# EAGLE design TRISThisv2p0 (EAGLE 5.12)

## Sheet 1 of 2
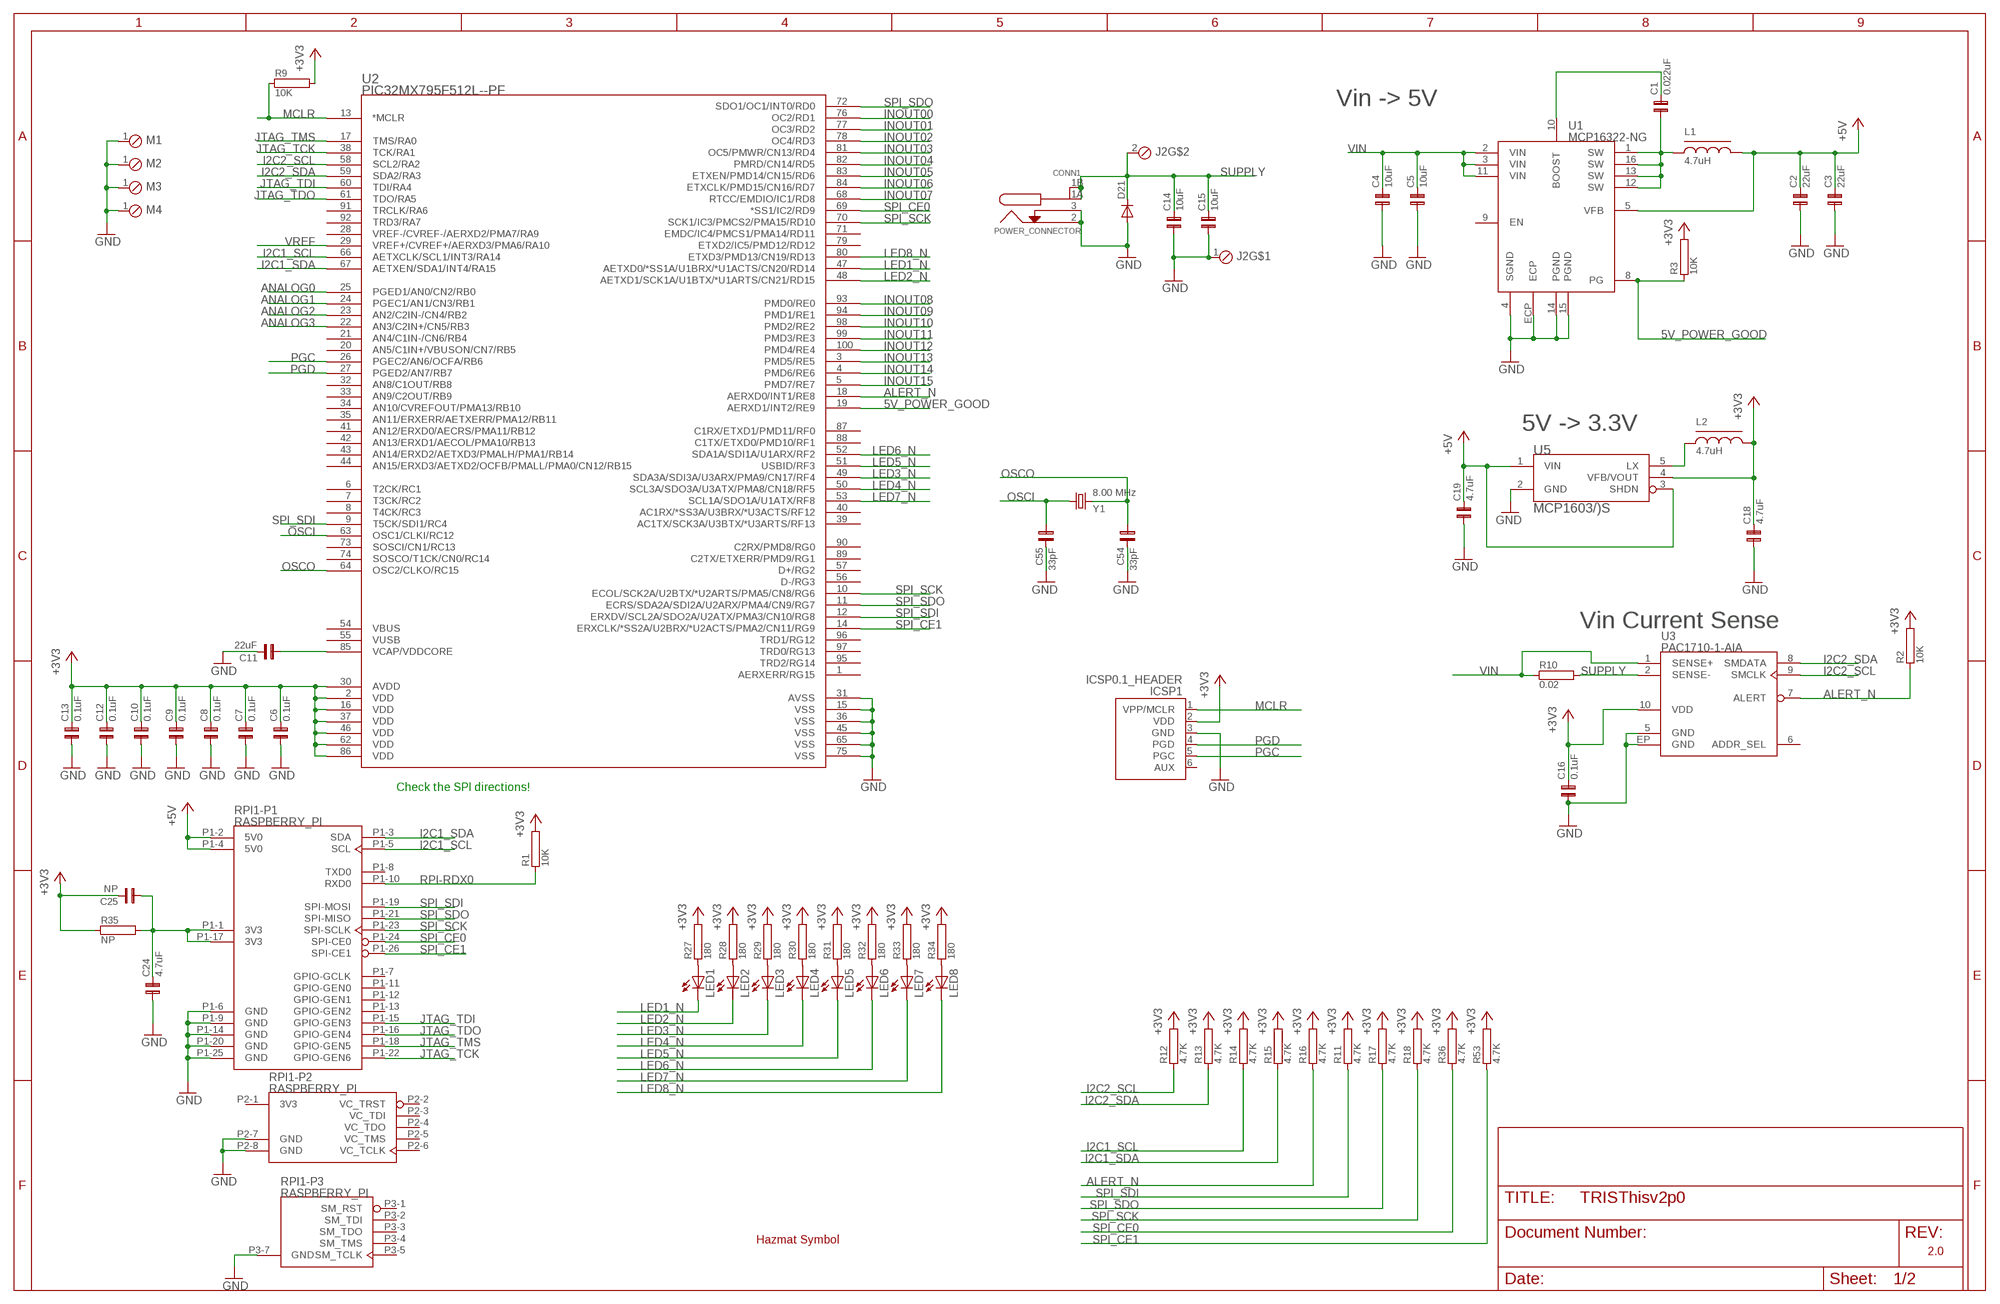
[diagram p0: schematic, sheet 1]

### Parts
C1  0.022uF  CU_SMT0603  [C0603]
C2  22uF  CU_SMT0805  [C0805]
C3  22uF  CU_SMT0805  [C0805]
C4  10uF  CU_SMT0805  [C0805]
C5  10uF  CU_SMT0805  [C0805]
C6  0.1uF  CU_SMT0603  [C0603]
C7  0.1uF  CU_SMT0603  [C0603]
C8  0.1uF  CU_SMT0603  [C0603]
C9  0.1uF  CU_SMT0603  [C0603]
C10  0.1uF  CU_SMT0603  [C0603]
C11  22uF  CU_SMT0805  [C0805]
C12  0.1uF  CU_SMT0603  [C0603]
C13  0.1uF  CU_SMT0603  [C0603]
C14  10uF  CU_SMT0805  [C0805]
C15  10uF  CU_SMT0805  [C0805]
C16  0.1uF  CU_SMT0603  [C0603]
C18  4.7uF  CU_SMT0805  [C0805]
C19  4.7uF  CU_SMT0805  [C0805]
C24  4.7uF  CU_SMT0805  [C0805]
C25  NP  CU_SMT0805  [C0805]
C54  33pF  CU_SMT0603  [C0603]
C55  33pF  CU_SMT0603  [C0603]
CONN1  POWER_CONNECTOR  [PJ-002BH-SMT]
D21  SOD-123  [SOD-123]
ICSP1  ICSP0.1_HEADER  [ICSP]
J2  2P_HEADER  [2POL254]
L1  4.7uH  L_SMTWE-PD  [WE-PD]
L2  4.7uH  L_SMTWE-PD  [WE-PD]
LED1  LEDCHIPLED_0603  [CHIPLED_0603]
LED2  LEDCHIPLED_0603  [CHIPLED_0603]
LED3  LEDCHIPLED_0603  [CHIPLED_0603]
LED4  LEDCHIPLED_0603  [CHIPLED_0603]
LED5  LEDCHIPLED_0603  [CHIPLED_0603]
LED6  LEDCHIPLED_0603  [CHIPLED_0603]
LED7  LEDCHIPLED_0603  [CHIPLED_0603]
LED8  LEDCHIPLED_0603  [CHIPLED_0603]
M1  MOUNTING  [0125_MOUNT]
M2  MOUNTING  [0125_MOUNT]
M3  MOUNTING  [0125_MOUNT]
M4  MOUNTING  [0125_MOUNT]
R1  10K  R_SMT0603  [R0603]
R2  10K  R_SMT0603  [R0603]
R3  10K  R_SMT0603  [R0603]
R9  10K  R_SMT0603  [R0603]
R10  0.02  R_SMT1210  [R1210]
R11  4.7K  R_SMT0603  [R0603]
R12  4.7K  R_SMT0603  [R0603]
R13  4.7K  R_SMT0603  [R0603]
R14  4.7K  R_SMT0603  [R0603]
R15  4.7K  R_SMT0603  [R0603]
R16  4.7K  R_SMT0603  [R0603]
R17  4.7K  R_SMT0603  [R0603]
R18  4.7K  R_SMT0603  [R0603]
R27  180  R_SMT0603  [R0603]
R28  180  R_SMT0603  [R0603]
R29  180  R_SMT0603  [R0603]
R30  180  R_SMT0603  [R0603]
R31  180  R_SMT0603  [R0603]
R32  180  R_SMT0603  [R0603]
R33  180  R_SMT0603  [R0603]
R34  180  R_SMT0603  [R0603]
R35  NP  R_SMT0603  [R0603]
R36  4.7K  R_SMT0603  [R0603]
R53  4.7K  R_SMT0603  [R0603]
RPI1  RASPBERRY_PI  [RPI]
U1  MCP16322-NG  [NG]
U2  PIC32MX795F512L--PF  [TQFP100_14X14]
U3  PAC1710-1-AIA  [DFN10]
U5  MCP1603/)S  MCP1603/OS  [TSOT5_MC]
U$1  HAZMATSYMBOL  [HAZMATSYMBOL]
Y1  8.00 MHz  CS10  [CS10]

### Nets
5V_POWER_GOOD: R3.1 U1.8(PG) U2.19(AERXD1/INT2/RE9)
+3V3: C6.2 C7.2 C8.2 C9.2 C10.2 C12.2 C13.2 C16.2 C18.2 C25.2 ICSP1.2(VDD) L2.2 R1.2 R2.2 R3.2 R9.2 R11.2 R12.2 R13.2 R14.2 R15.2 R16.2 R17.2 R18.2 R27.2 R28.2 R29.2 R30.2 R31.2 R32.2 R33.2 R34.2 R35.1 R36.2 R53.2 U2.2(VDD) U2.16(VDD) U2.30(AVDD) U2.37(VDD) U2.46(VDD) U2.62(VDD) U2.86(VDD) U3.10(VDD) U5.4(VFB/VOUT) ; also sheet 2
+5V: C2.2 C3.2 C19.2 L1.2 RPI1.P1-2(-P1:5V0) RPI1.P1-4(-P1:5V0) U1.5(VFB) U5.1(VIN) U5.3(SHDN)
ALERT_N: R2.1 R16.1 U2.18(AERXD0/INT1/RE8) U3.7(ALERT)
ANALOG0: U2.25(PGED1/AN0/CN2/RB0) ; also sheet 2
ANALOG1: U2.24(PGEC1/AN1/CN3/RB1) ; also sheet 2
ANALOG2: U2.23(AN2/C2IN-/CN4/RB2) ; also sheet 2
ANALOG3: U2.22(AN3/C2IN+/CN5/RB3) ; also sheet 2
BOOST: C1.2 U1.10(BOOST)
GND: C2.1 C3.1 C4.1 C5.1 C6.1 C7.1 C8.1 C9.1 C10.1 C11.2 C12.1 C13.1 C14.1 C15.1 C16.1 C18.1 C19.1 C24.1 C54.2 C55.2 CONN1.2(SHIELD) CONN1.3(SHIELD_SWITCHED) D21.A ICSP1.3(GND) J2.1 M1.1 M2.1 M3.1 M4.1 RPI1.P1-6(-P1:GND) RPI1.P1-9(-P1:GND) RPI1.P1-14(-P1:GND) RPI1.P1-20(-P1:GND) RPI1.P1-25(-P1:GND) RPI1.P2-7(-P2:GND) RPI1.P2-8(-P2:GND) RPI1.P3-7(-P3:GND) U1.4(SGND) U1.14(PGND) U1.15(PGND) U1.ECP U2.15(VSS) U2.31(AVSS) U2.36(VSS) U2.45(VSS) U2.65(VSS) U2.75(VSS) U3.5(GND) U3.EP(GND) U5.2(GND) ; also sheet 2
I2C1_SCL: R14.1 RPI1.P1-5(-P1:SCL) U2.66(AETXCLK/SCL1/INT3/RA14)
I2C1_SDA: R15.1 RPI1.P1-3(-P1:SDA) U2.67(AETXEN/SDA1/INT4/RA15)
I2C2_SCL: R12.1 U2.58(SCL2/RA2) U3.9(SMCLK) ; also sheet 2
I2C2_SDA: R13.1 U2.59(SDA2/RA3) U3.8(SMDATA) ; also sheet 2
INOUT00: U2.76(OC2/RD1) ; also sheet 2
INOUT01: U2.77(OC3/RD2) ; also sheet 2
INOUT02: U2.78(OC4/RD3) ; also sheet 2
INOUT03: U2.81(OC5/PMWR/CN13/RD4) ; also sheet 2
INOUT04: U2.82(PMRD/CN14/RD5) ; also sheet 2
INOUT05: U2.83(ETXEN/PMD14/CN15/RD6) ; also sheet 2
INOUT06: U2.84(ETXCLK/PMD15/CN16/RD7) ; also sheet 2
INOUT07: U2.68(RTCC/EMDIO/IC1/RD8) ; also sheet 2
INOUT08: U2.93(PMD0/RE0) ; also sheet 2
INOUT09: U2.94(PMD1/RE1) ; also sheet 2
INOUT10: U2.98(PMD2/RE2) ; also sheet 2
INOUT11: U2.99(PMD3/RE3) ; also sheet 2
INOUT12: U2.100(PMD4/RE4) ; also sheet 2
INOUT13: U2.3(PMD5/RE5) ; also sheet 2
INOUT14: U2.4(PMD6/RE6) ; also sheet 2
INOUT15: U2.5(PMD7/RE7) ; also sheet 2
JTAG_TCK: RPI1.P1-22(-P1:GPIO-GEN6) U2.38(TCK/RA1)
JTAG_TDI: RPI1.P1-15(-P1:GPIO-GEN3) U2.60(TDI/RA4)
JTAG_TDO: RPI1.P1-16(-P1:GPIO-GEN4) U2.61(TDO/RA5)
JTAG_TMS: RPI1.P1-18(-P1:GPIO-GEN5) U2.17(TMS/RA0)
LED1_N: LED1.C U2.47(AETXD0/*SS1A/U1BRX/*U1ACTS/CN20/RD14)
LED2_N: LED2.C U2.48(AETXD1/SCK1A/U1BTX/*U1ARTS/CN21/RD15)
LED3_N: LED3.C U2.49(SDA3A/SDI3A/U3ARX/PMA9/CN17/RF4)
LED4_N: LED4.C U2.50(SCL3A/SDO3A/U3ATX/PMA8/CN18/RF5)
LED5_N: LED5.C U2.51(USBID/RF3)
LED6_N: LED6.C U2.52(SDA1A/SDI1A/U1ARX/RF2)
LED7_N: LED7.C U2.53(SCL1A/SDO1A/U1ATX/RF8)
LED8_N: LED8.C U2.80(ETXD3/PMD13/CN19/RD13)
MCLR: ICSP1.1(VPP/MCLR) R9.1 U2.13(*MCLR)
N$5: LED1.A R27.1
N$11: LED2.A R28.1
N$13: LED3.A R29.1
N$14: LED4.A R30.1
N$15: LED5.A R31.1
N$16: LED6.A R32.1
N$17: LED7.A R33.1
N$18: LED8.A R34.1
OSCI: C55.1 U2.63(OSC1/CLKI/RC12) Y1.P$1
OSCO: C54.1 U2.64(OSC2/CLKO/RC15) Y1.P$2
PGC: ICSP1.5(PGC) U2.26(PGEC2/AN6/OCFA/RB6)
PGD: ICSP1.4(PGD) U2.27(PGED2/AN7/RB7)
RPI+3V3: C24.2 C25.1 R35.2 RPI1.P1-1(-P1:3V3) RPI1.P1-17(-P1:3V3)
RPI-RDX0: R1.1 RPI1.P1-10(-P1:RXD0)
SPI_CE0: R36.1 RPI1.P1-24(-P1:SPI-CE0) U2.69(*SS1/IC2/RD9)
SPI_CE1: R53.1 RPI1.P1-26(-P1:SPI-CE1) U2.14(ERXCLK/*SS2A/U2BRX/*U2ACTS/PMA2/CN11/RG9)
SPI_SCK: R18.1 RPI1.P1-23(-P1:SPI-SCLK) U2.10(ECOL/SCK2A/U2BTX/*U2ARTS/PMA5/CN8/RG6) U2.70(SCK1/IC3/PMCS2/PMA15/RD10)
SPI_SDI: R11.1 RPI1.P1-19(-P1:SPI-MOSI) U2.9(T5CK/SDI1/RC4) U2.12(ERXDV/SCL2A/SDO2A/U2ATX/PMA3/CN10/RG8)
SPI_SDO: R17.1 RPI1.P1-21(-P1:SPI-MISO) U2.11(ECRS/SDA2A/SDI2A/U2ARX/PMA4/CN9/RG7) U2.72(SDO1/OC1/INT0/RD0)
SUPPLY: C14.2 C15.2 CONN1.1A(CENTER-1) CONN1.1B(CENTER-2) D21.K J2.2 R10.2 U3.2(SENSE-)
SW: C1.1 L1.1 U1.1(SW) U1.12(SW) U1.13(SW) U1.16(SW)
U5_SWITCH: L2.1 U5.5(LX)
VDDCORE: C11.1 U2.85(VCAP/VDDCORE)
VIN: C4.2 C5.2 R10.1 U1.2(VIN) U1.3(VIN) U1.11(VIN) U3.1(SENSE+)
VREF: U2.29(VREF+/CVREF+/AERXD3/PMA6/RA10) ; also sheet 2
Unconnected: ICSP1.6(AUX) RPI1.P1-7(-P1:GPIO-GCLK) RPI1.P1-8(-P1:TXD0) RPI1.P1-11(-P1:GPIO-GEN0) RPI1.P1-12(-P1:GPIO-GEN1) RPI1.P1-13(-P1:GPIO-GEN2) RPI1.P2-2(-P2:VC_TRST) RPI1.P2-3(-P2:VC_TDI) RPI1.P2-4(-P2:VC_TDO) RPI1.P2-5(-P2:VC_TMS) RPI1.P2-6(-P2:VC_TCLK) RPI1.P3-1(-P3:SM_RST) RPI1.P3-2(-P3:SM_TDI) RPI1.P3-3(-P3:SM_TDO) RPI1.P3-4(-P3:SM_TMS) RPI1.P3-5(-P3:SM_TCLK) U1.9(EN) U2.1(AERXERR/RG15) U2.6(T2CK/RC1) U2.7(T3CK/RC2) U2.8(T4CK/RC3) U2.20(AN5/C1IN+/VBUSON/CN7/RB5) U2.21(AN4/C1IN-/CN6/RB4) U2.28(VREF-/CVREF-/AERXD2/PMA7/RA9) U2.32(AN8/C1OUT/RB8) U2.33(AN9/C2OUT/RB9) U2.34(AN10/CVREFOUT/PMA13/RB10) U2.35(AN11/ERXERR/AETXERR/PMA12/RB11) U2.39(AC1TX/SCK3A/U3BTX/*U3ARTS/RF13) U2.40(AC1RX/*SS3A/U3BRX/*U3ACTS/RF12) U2.41(AN12/ERXD0/AECRS/PMA11/RB12) U2.42(AN13/ERXD1/AECOL/PMA10/RB13) U2.43(AN14/ERXD2/AETXD3/PMALH/PMA1/RB14) U2.44(AN15/ERXD3/AETXD2/OCFB/PMALL/PMA0/CN12/RB15) U2.54(VBUS) U2.55(VUSB) U2.56(D-/RG3) U2.57(D+/RG2) U2.71(EMDC/IC4/PMCS1/PMA14/RD11) U2.73(SOSCI/CN1/RC13) U2.74(SOSCO/T1CK/CN0/RC14) U2.79(ETXD2/IC5/PMD12/RD12) U2.87(C1RX/ETXD1/PMD11/RF0) U2.88(C1TX/ETXD0/PMD10/RF1) U2.89(C2TX/ETXERR/PMD9/RG1) U2.90(C2RX/PMD8/RG0) U2.91(TRCLK/RA6) U2.92(TRD3/RA7) U2.95(TRD2/RG14) U2.96(TRD1/RG12) U2.97(TRD0/RG13) U3.6(ADDR_SEL)

### Notes on the sheet
- Vin -> 5V
- 5V -> 3.3V
- Vin Current Sense
- Check the SPI directions!
- 2.0

## Sheet 2 of 2
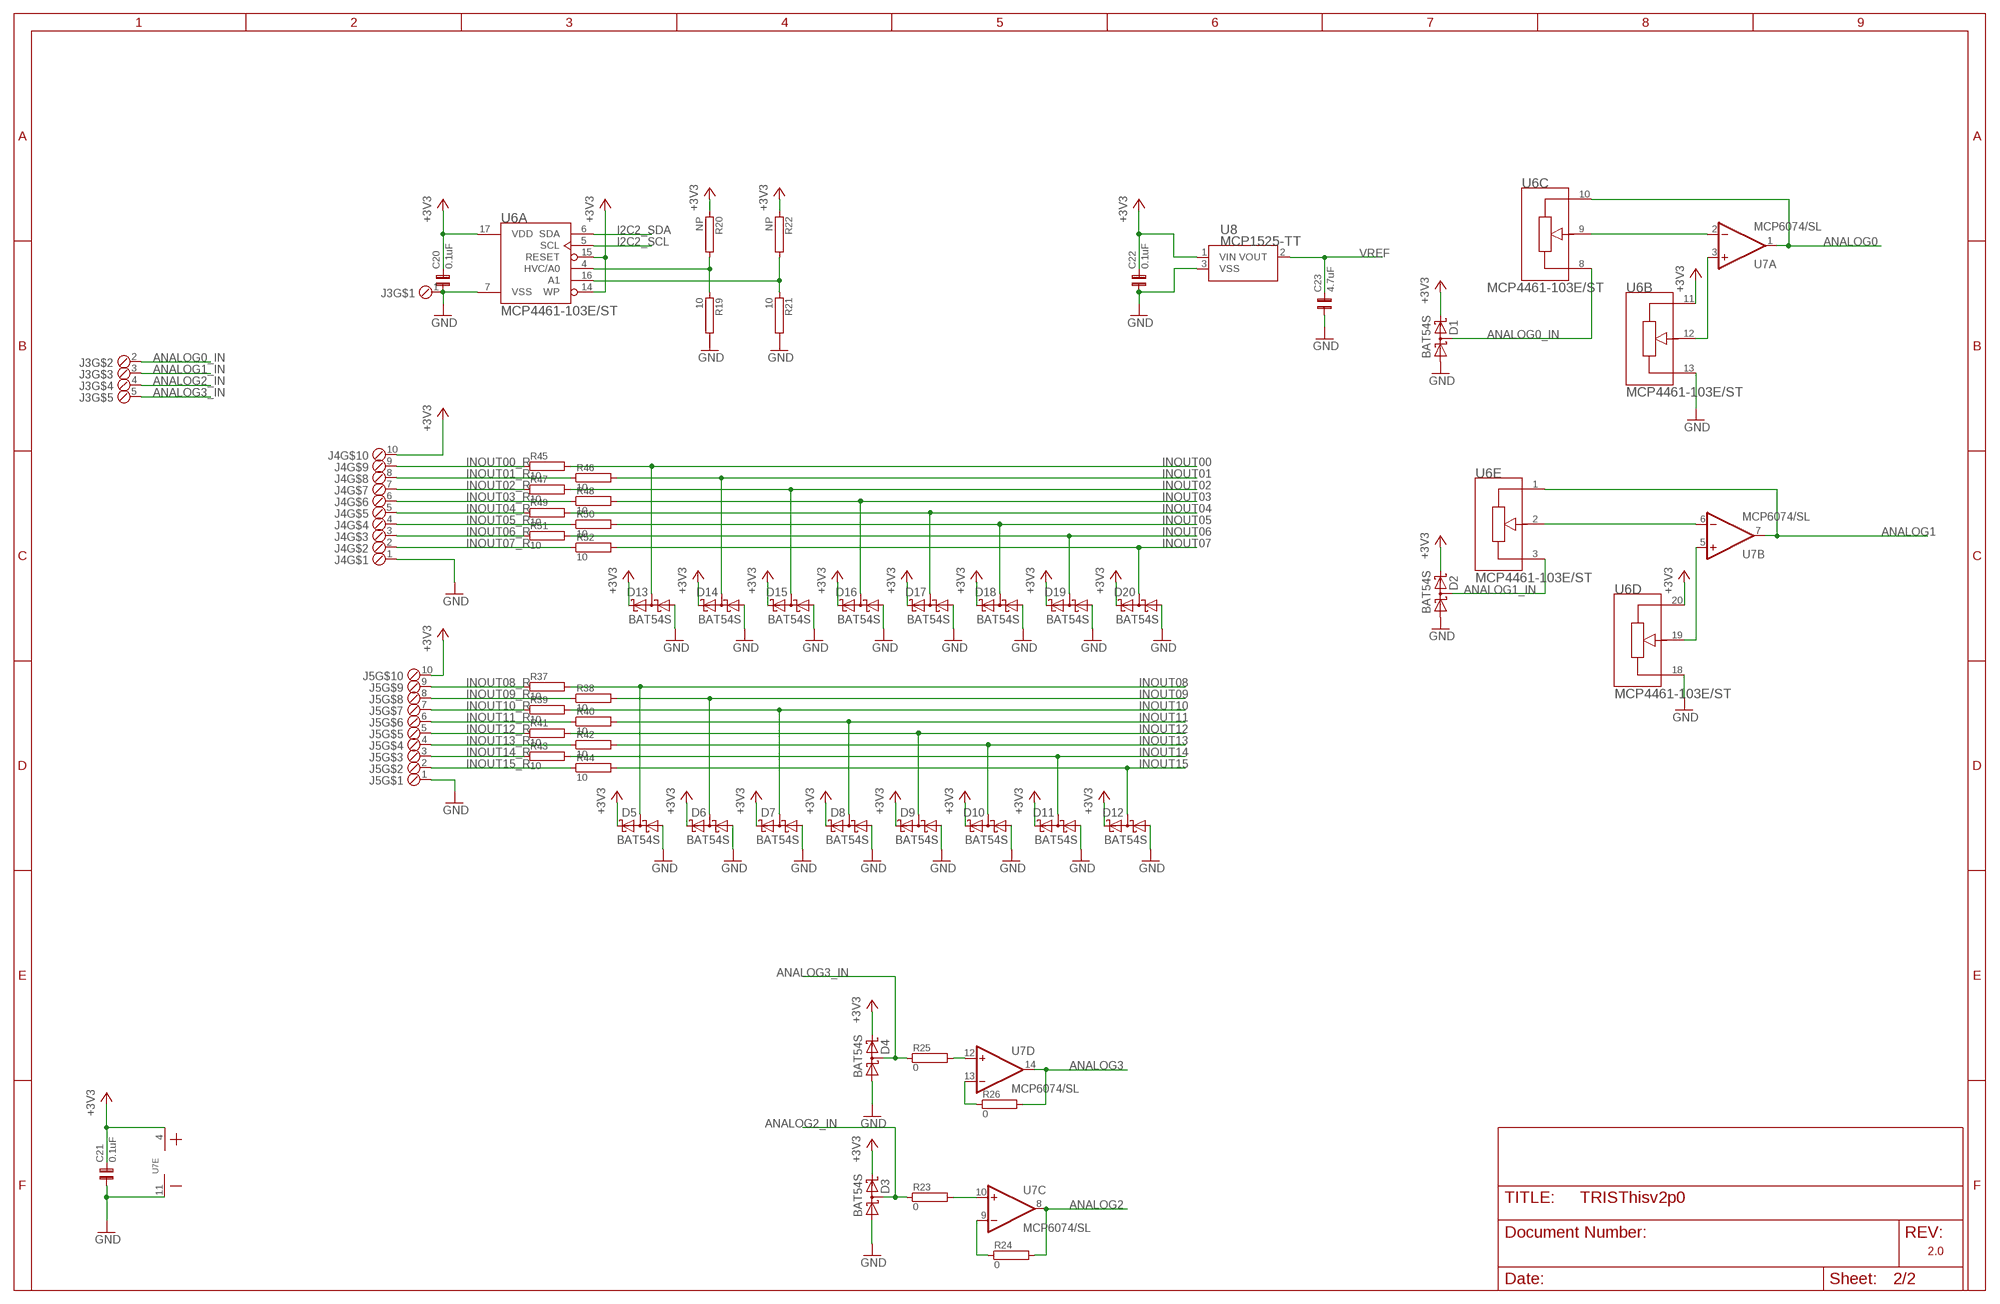
[diagram p1: schematic, sheet 2]

### Parts
C20  0.1uF  CU_SMT0603  [C0603]
C21  0.1uF  CU_SMT0603  [C0603]
C22  0.1uF  CU_SMT0603  [C0603]
C23  4.7uF  CU_SMT0603  [C0603]
D1  BAT54S  [SOT23]
D2  BAT54S  [SOT23]
D3  BAT54S  [SOT23]
D4  BAT54S  [SOT23]
D5  BAT54S  [SOT23]
D6  BAT54S  [SOT23]
D7  BAT54S  [SOT23]
D8  BAT54S  [SOT23]
D9  BAT54S  [SOT23]
D10  BAT54S  [SOT23]
D11  BAT54S  [SOT23]
D12  BAT54S  [SOT23]
D13  BAT54S  [SOT23]
D14  BAT54S  [SOT23]
D15  BAT54S  [SOT23]
D16  BAT54S  [SOT23]
D17  BAT54S  [SOT23]
D18  BAT54S  [SOT23]
D19  BAT54S  [SOT23]
D20  BAT54S  [SOT23]
J3  5P_HEADER  [5POL254]
J4  10P_HEADER  [10POL254]
J5  10P_HEADER  [10POL254]
R19  10  R_SMT0603  [R0603]
R20  NP  R_SMT0603  [R0603]
R21  10  R_SMT0603  [R0603]
R22  NP  R_SMT0603  [R0603]
R23  0  R_SMT0603  [R0603]
R24  0  R_SMT0603  [R0603]
R25  0  R_SMT0603  [R0603]
R26  0  R_SMT0603  [R0603]
R37  10  R_SMT0603  [R0603]
R38  10  R_SMT0603  [R0603]
R39  10  R_SMT0603  [R0603]
R40  10  R_SMT0603  [R0603]
R41  10  R_SMT0603  [R0603]
R42  10  R_SMT0603  [R0603]
R43  10  R_SMT0603  [R0603]
R44  10  R_SMT0603  [R0603]
R45  10  R_SMT0603  [R0603]
R46  10  R_SMT0603  [R0603]
R47  10  R_SMT0603  [R0603]
R48  10  R_SMT0603  [R0603]
R49  10  R_SMT0603  [R0603]
R50  10  R_SMT0603  [R0603]
R51  10  R_SMT0603  [R0603]
R52  10  R_SMT0603  [R0603]
U6  MCP4461-103E/ST  MCP4461/ST  [TSSOP20_MC]
U7  MCP6074/SL  [SOIC14-N_MC]
U8  MCP1525-TT  [SOT-23_MC]

### Nets
+3V3: C20.2 C21.2 C22.2 D1.2(C2) D2.2(C2) D3.2(C2) D4.2(C2) D5.2(C2) D6.2(C2) D7.2(C2) D8.2(C2) D9.2(C2) D10.2(C2) D11.2(C2) D12.2(C2) D13.2(C2) D14.2(C2) D15.2(C2) D16.2(C2) D17.2(C2) D18.2(C2) D19.2(C2) D20.2(C2) J4.10 J5.10 R20.1 R22.1 U6.11(B:A) U6.14(A:WP) U6.15(A:RESET) U6.17(A:VDD) U6.20(D:A) U7.4(E:V+) U8.1(VIN) ; also sheet 1
ADDR_SEL2: R19.1 R20.2 U6.4(A:HVC/A0)
ADDR_SEL3: R21.1 R22.2 U6.16(A:A1)
ANALOG0: U6.10(C:A) U7.1(A:OUT) ; also sheet 1
ANALOG0_IN: D1.3(C1A2) J3.2 U6.8(C:B)
ANALOG1: U6.1(E:A) U7.7(B:OUT) ; also sheet 1
ANALOG1_IN: D2.3(C1A2) J3.3 U6.3(E:B)
ANALOG2: R24.2 U7.8(C:OUT) ; also sheet 1
ANALOG2_IN: D3.3(C1A2) J3.4 R23.1
ANALOG3: R26.2 U7.14(D:OUT) ; also sheet 1
ANALOG3_IN: D4.3(C1A2) J3.5 R25.1
GND: C20.1 C21.1 C22.1 C23.1 D1.1(A1) D2.1(A1) D3.1(A1) D4.1(A1) D5.1(A1) D6.1(A1) D7.1(A1) D8.1(A1) D9.1(A1) D10.1(A1) D11.1(A1) D12.1(A1) D13.1(A1) D14.1(A1) D15.1(A1) D16.1(A1) D17.1(A1) D18.1(A1) D19.1(A1) D20.1(A1) J3.1 J4.1 J5.1 R19.2 R21.2 U6.7(A:VSS) U6.13(B:B) U6.18(D:B) U7.11(E:V-) U8.3(VSS) ; also sheet 1
I2C2_SCL: U6.5(A:SCL) ; also sheet 1
I2C2_SDA: U6.6(A:SDA) ; also sheet 1
INOUT00: D13.3(C1A2) R45.2 ; also sheet 1
INOUT00_R: J4.9 R45.1
INOUT01: D14.3(C1A2) R46.2 ; also sheet 1
INOUT01_R: J4.8 R46.1
INOUT02: D15.3(C1A2) R47.2 ; also sheet 1
INOUT02_R: J4.7 R47.1
INOUT03: D16.3(C1A2) R48.2 ; also sheet 1
INOUT03_R: J4.6 R48.1
INOUT04: D17.3(C1A2) R49.2 ; also sheet 1
INOUT04_R: J4.5 R49.1
INOUT05: D18.3(C1A2) R50.2 ; also sheet 1
INOUT05_R: J4.4 R50.1
INOUT06: D19.3(C1A2) R51.2 ; also sheet 1
INOUT06_R: J4.3 R51.1
INOUT07: D20.3(C1A2) R52.2 ; also sheet 1
INOUT07_R: J4.2 R52.1
INOUT08: D5.3(C1A2) R37.2 ; also sheet 1
INOUT08_R: J5.9 R37.1
INOUT09: D6.3(C1A2) R38.2 ; also sheet 1
INOUT09_R: J5.8 R38.1
INOUT10: D7.3(C1A2) R39.2 ; also sheet 1
INOUT10_R: J5.7 R39.1
INOUT11: D8.3(C1A2) R40.2 ; also sheet 1
INOUT11_R: J5.6 R40.1
INOUT12: D9.3(C1A2) R41.2 ; also sheet 1
INOUT12_R: J5.5 R41.1
INOUT13: D10.3(C1A2) R42.2 ; also sheet 1
INOUT13_R: J5.4 R42.1
INOUT14: D11.3(C1A2) R43.2 ; also sheet 1
INOUT14_R: J5.3 R43.1
INOUT15: D12.3(C1A2) R44.2 ; also sheet 1
INOUT15_R: J5.2 R44.1
N$3: R26.1 U7.13(D:-IN)
N$4: U6.12(B:W) U7.3(A:+IN)
N$6: U6.9(C:W) U7.2(A:-IN)
N$7: U6.19(D:W) U7.5(B:+IN)
N$8: U6.2(E:W) U7.6(B:-IN)
N$9: R23.2 U7.10(C:+IN)
N$12: R25.2 U7.12(D:+IN)
U7C_INVERTING: R24.1 U7.9(C:-IN)
VREF: C23.2 U8.2(VOUT) ; also sheet 1

### Notes on the sheet
- 2.0

## Power pins joined to a net without a drawn wire
3V3: RPI1.P2-1(-P2:3V3)

## Library data of the parts
C1-C5 C11 C14 C15 C18 C19 C24 C25 = V3:CU_SMT: Unpolarized surface mount capacitors
C6-C10 C12 C13 C16 C20-C23 = TRISThis:CU_SMT: Unpolarized surface mount capacitors
C54 C55 = PLM_Demo:CU_SMT: Unpolarized surface mount capacitors
CONN1 = untitled:POWER_CONNECTOR
D1-D20 = PLM_Demo:BAT54S
D21 = TridentSMD:SOD-123
ICSP1 = TRISThis:ICSP: Microchip ICSP connector
J2 = TRISThisConnectors:2P_HEADER: Buchanan 282834-2
J3 = TRISThisConnectors:5P_HEADER: Buchanan 282834-5
J4 J5 = TRISThisConnectors:10P_HEADER: Buchanan 282834-10
L1 L2 = MCP1632x:L_SMT
LED1-LED8 = PLM_Demo:LED: LED OSRAM: - CHIPLED LG R971, LG N971, LY N971, LG Q971, LY Q971, LO R971, LY R971 LH N974, LH R974 LS Q976, LO Q976, LY Q976 LO Q996 - Hyper CHIPLED LW Q18S LB Q993, LB Q99A, LB R99A - SideLED LS A670, LO A670, LY A670, LG A670, LP A670 LB A673, LV A673, LT A673, LW A673 LH A674 LY A675 LS A676, LA A676, LO A676, LY A676, LW A676 LS A679, LY A679, LG A679 - Hyper Micro SIDELED® LS Y876, LA Y876, LO Y876, LY Y876 LT Y87S - SmartLED LW L88C, LW L88S LB L89C, LB L89S, LG L890 LS L89K, LO L89K, LY L89K LS L896, LA L896, LO L896, LY L896 - TOPLED LS T670, LO T670, LY T670, LG T670, LP T670 LSG T670, LSP T670, LSY T670, LOP T670, LYG T670 LG T671, LOG T671, LSG T671 LB T673, LV T673, LT T673, LW T673 LH T674 LS T676, LA T676, LO T676, LY T676, LB T676, LH T676, LSB T676, LW T676 LB T67C, LV T67C, LT T67C, LS T67K, LO T67K, LY T67K, LW E67C LS E67B, LA E67B, LO E67B, LY E67B, LB E67C, LV E67C, LT E67C LW T67C LS T679, LY T679, LG T679 LS T770, LO T770, LY T770, LG T770, LP T770 LB T773, LV T773, LT T773, LW T773 LH T774 LS E675, LA E675, LY E675, LS T675 LS T776, LA T776, LO T776, LY T776, LB T776 LHGB T686 LT T68C, LB T68C - Hyper Mini TOPLED® LB M676 - Mini TOPLED Santana® LG M470 LS M47K, LO M47K, LY M47K Source: http://www.osram.convergy.de - LUMILED® LXK2-PW12-R00, LXK2-PW12-S00, LXK2-PW14-U00, LXK2-PW14-V00 LXK2-PM12-R00, LXK2-PM12-S00, LXK2-PM14-U00 LXK2-PE12-Q00, LXK2-PE12-R00, LXK2-PE12-S00, LXK2-PE14-T00, LXK2-PE14-U00 LXK2-PB12-K00, LXK2-PB12-L00, LXK2-PB12-M00, LXK2-PB14-N00, LXK2-PB14-P00, LXK2-PB14-Q00 LXK2-PR12-L00, LXK2-PR12-M00, LXK2-PR14-Q00, LXK2-PR14-R00 LXK2-PD12-Q00, LXK2-PD12-R00, LXK2-PD12-S00 LXK2-PH12-R00, LXK2-PH12-S00 LXK2-PL12-P00, LXK2-PL12-Q00, LXK2-PL12-R00 Source: www.luxeon.com
M1-M4 = TRISThisConnectors:MOUNTING
R1 R9-R53 = TRISThis:R_SMT
R2 R3 = V3:R_SMT
RPI1 = RaspberryPi:RASPBERRY_PI
U1 = MCP1632x:MCP16322
U2 = TRISThis:PIC32MX795F512L-
U3 = PAC1710:PAC1710-1
U5 = MCP1603:MCP1603
U6 = MCP4461:MCP4461
U7 = MCP6074:MCP6074
U8 = batterymon:MCP1525
U$1 = mjb-custom:HAZMATSYMBOL
Y1 = PLM_Demo:CS10

## Board
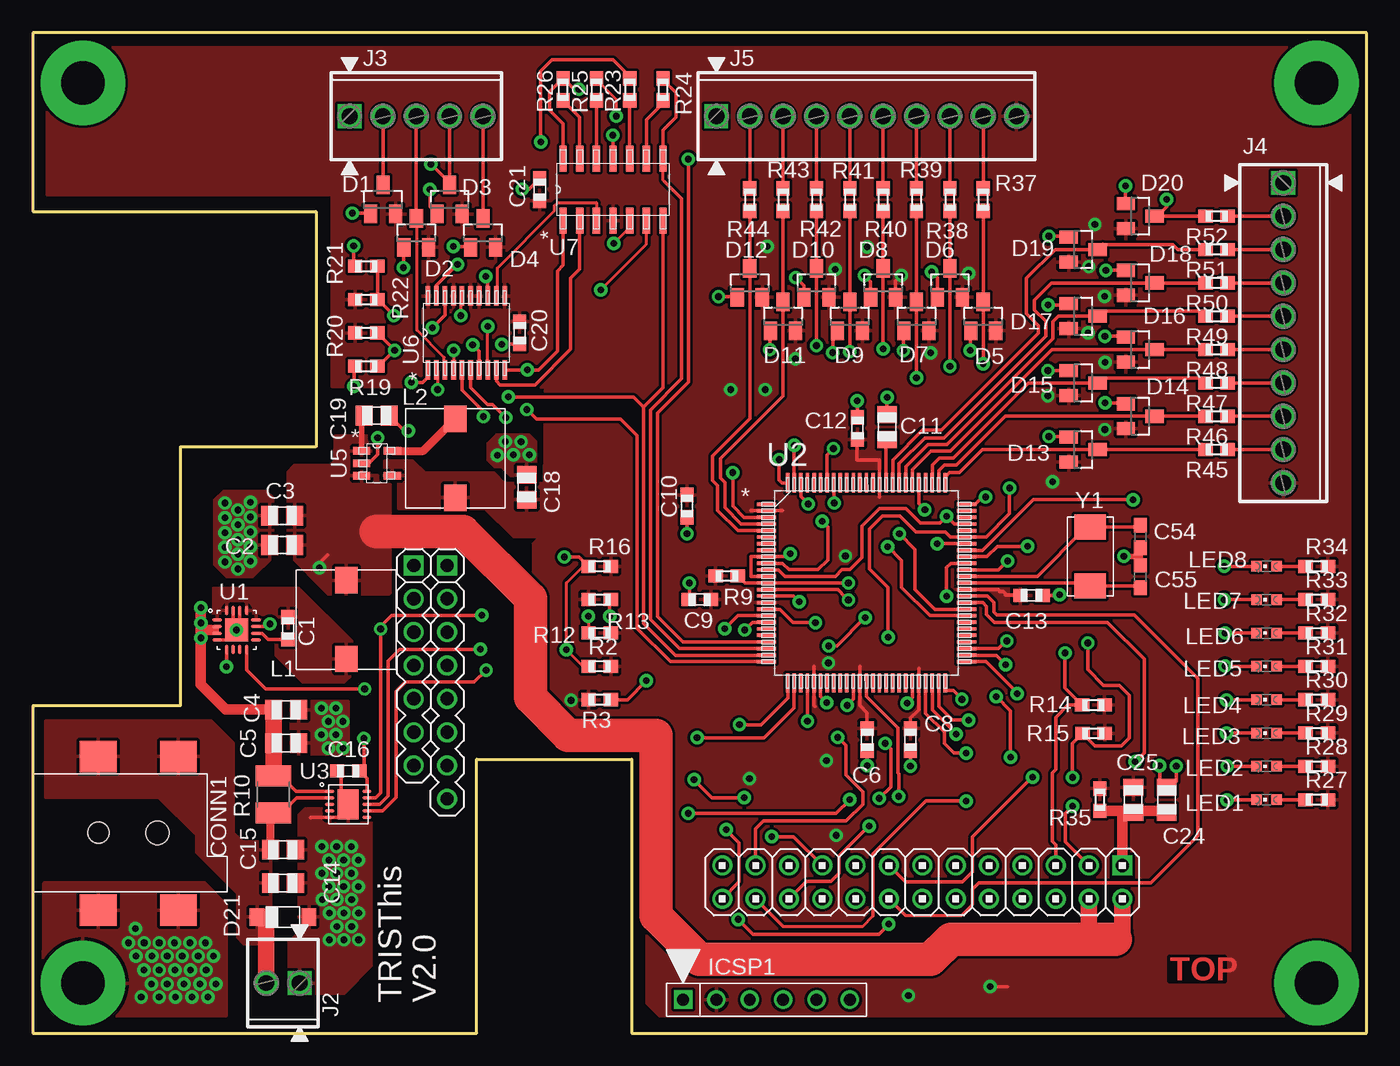
[diagram p2: board, top side]
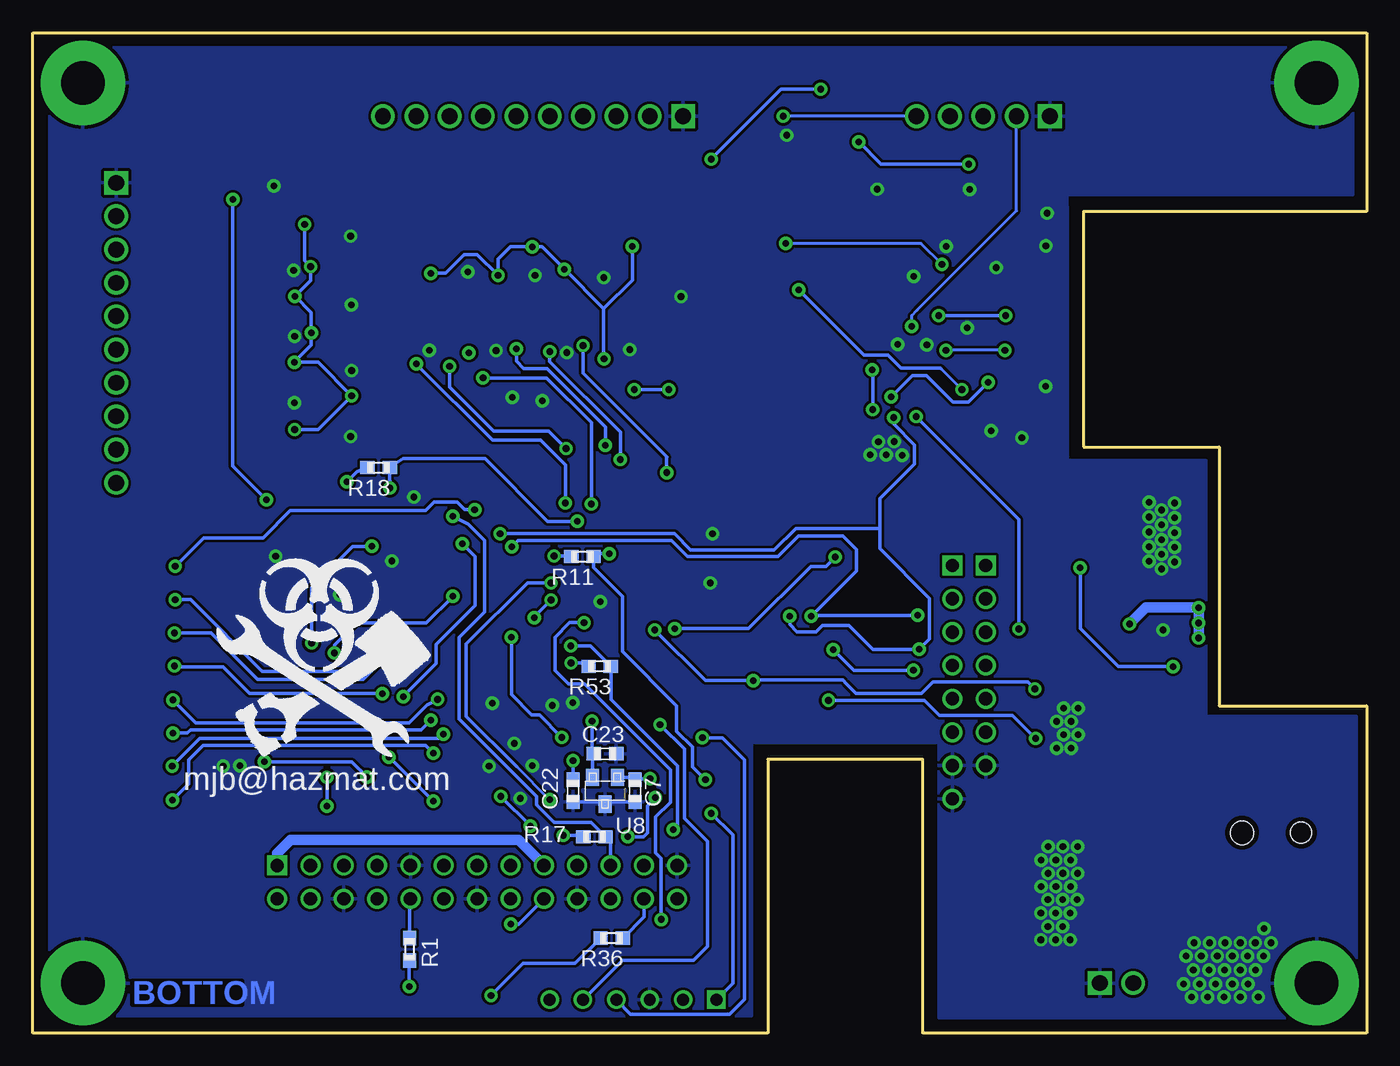
[diagram p3: board, bottom side, seen from below]

Size 101.6 x 76.2 mm. Coordinates in mm from the lower left corner, seen from the top.
Outline: 0,0 33.81,0 33.81,20.85 45.62,20.85 45.62,0 101.6,0 101.6,76.2 0,76.2 0,62.59 21.57,62.59 21.57,44.65 11.23,44.65 11.23,24.94 0,24.94 0,0
Copper layers (1*16): Top 0.035mm / dielectric 1mm / Bottom 0.035mm
Design rules "default *": minimum track width 9.5mil, minimum drill 20mil, track to track 8mil, track to pad 8mil, pad to pad 8mil, via to via 8mil, smd to smd 0mil, copper to edge 15mil, drill to drill 20mil, minimum pad ring 10mil, minimum via ring 10mil, stop-mask expansion 0mil, vias tented up to drill 21mil, thermal gap 10mil

### Footprints (pad centres in the part's own frame; a part is rotated, then mirrored left to right if it is on the bottom)
C0603 = smd 1.1 x 1: 1 -0.85,0; 2 0.85,0
C0805 = smd 1.3 x 1.5: 1 -0.95,0; 2 0.95,0
PJ-002BH-SMT = smd 2.8 x 2.4: 1A -2.4,5.8; 1B 3.7,5.8; 2 -2.4,-5.9; 3 3.7,-5.9 | hole 1.6: -2.4,0 | hole 1.8: 2.1,0
SOT23 = smd 1 x 1.4: 1 -0.95,-1.1; 2 0.95,-1.1; 3 0,1.1
SOD-123 = smd 1.092 x 1.295: A 1.981,-0.051; K -1.981,-0.051
ICSP = drill 0.9 square: 1 -6.35,0 | drill 0.9 round: 2 -3.81,0; 3 -1.27,0; 4 1.27,0; 5 3.81,0; 6 6.35,0
2POL254 = drill 1.2 square: 1 -1.27,0 | drill 1.2 round: 2 1.27,0
5POL254 = drill 1.2 square: 1 -5.08,0 | drill 1.2 round: 2 -2.54,0; 3 0,0; 4 2.54,0; 5 5.08,0
10POL254 = drill 1.2 square: 1 -11.43,0 | drill 1.2 round: 2 -8.89,0; 3 -6.35,0; 4 -3.81,0; 5 -1.27,0; 6 1.27,0; 7 3.81,0; 8 6.35,0; 9 8.89,0; 10 11.43,0
WE-PD = smd 1.7 x 2: 1 0,3; 2 0,-3
CHIPLED_0603 = smd 0.8 x 0.8: A 0,-0.75; C 0,0.75
0125_MOUNT = drill 3.302 pad 6.452 round: 1 0,0
R0603 = smd 1.1 x 1: 1 -0.85,0; 2 0.85,0
R1210 = smd 1.6 x 2.7: 1 -1.4,0; 2 1.4,0
RPI = drill 1.016 square: P1-1 -5.144,-2.095; P2-1 -28.003,-53.531; P3-1 -28.003,-56.071 | drill 1.016 round: P1-2 -2.603,-2.095; P1-3 -5.144,-4.636; P1-4 -2.603,-4.636; P1-5 -5.144,-7.176; P1-6 -2.603,-7.176; P1-7 -5.144,-9.716; P1-8 -2.603,-9.716; P1-9 -5.144,-12.255; P1-10 -2.603,-12.255; P1-11 -5.144,-14.796; P1-12 -2.603,-14.796; P1-13 -5.144,-17.335; P1-14 -2.603,-17.335; P1-15 -5.144,-19.875; P1-16 -2.603,-19.875; P1-17 -5.144,-22.416; P1-18 -2.603,-22.416; P1-19 -5.144,-24.956; P1-20 -2.603,-24.956; P1-21 -5.144,-27.495; P1-22 -2.603,-27.495; P1-23 -5.144,-30.035; P1-24 -2.603,-30.035; P1-25 -5.144,-32.575; P1-26 -2.603,-32.575; P2-2 -25.463,-53.531; P2-3 -22.924,-53.531; P2-4 -20.384,-53.531; P2-5 -17.843,-53.531; P2-6 -15.303,-53.531; P2-7 -12.764,-53.531; P2-8 -10.223,-53.531; P3-2 -25.463,-56.071; P3-3 -22.924,-56.071; P3-4 -20.384,-56.071; P3-5 -17.843,-56.071; P3-6 -15.303,-56.071; P3-7 -12.764,-56.071
NG = smd 0.737 x 0.267: 1 -1.475,0.75; 2 -1.475,0.25; 3 -1.475,-0.25; 4 -1.475,-0.75; 9 1.475,-0.75; 10 1.475,-0.25; 11 1.475,0.25; 12 1.475,0.75 | smd 0.267 x 0.737: 5 -0.75,-1.475; 6 -0.25,-1.475; 7 0.25,-1.475; 8 0.75,-1.475; 13 0.75,1.475; 14 0.25,1.475; 15 -0.25,1.475; 16 -0.75,1.475 | smd 1.753 x 1.753: ECP 0,0
TQFP100_14X14 = smd 1.473 x 0.254: 1 -7.62,5.994; 2 -7.62,5.512; 3 -7.62,5.004; 4 -7.62,4.496; 5 -7.62,3.988; 6 -7.62,3.505; 7 -7.62,2.997; 8 -7.62,2.489; 9 -7.62,2.007; 10 -7.62,1.499; 11 -7.62,0.991; 12 -7.62,0.508; 13 -7.62,0; 14 -7.62,-0.508; 15 -7.62,-0.991; 16 -7.62,-1.499; 17 -7.62,-2.007; 18 -7.62,-2.489; 19 -7.62,-2.997; 20 -7.62,-3.505; 21 -7.62,-3.988; 22 -7.62,-4.496; 23 -7.62,-5.004; 24 -7.62,-5.512; 25 -7.62,-5.994; 51 7.62,-5.994; 52 7.62,-5.512; 53 7.62,-5.004; 54 7.62,-4.496; 55 7.62,-3.988; 56 7.62,-3.505; 57 7.62,-2.997; 58 7.62,-2.489; 59 7.62,-2.007; 60 7.62,-1.499; 61 7.62,-0.991; 62 7.62,-0.508; 63 7.62,0; 64 7.62,0.508; 65 7.62,0.991; 66 7.62,1.499; 67 7.62,2.007; 68 7.62,2.489; 69 7.62,2.997; 70 7.62,3.505; 71 7.62,3.988; 72 7.62,4.496; 73 7.62,5.004; 74 7.62,5.512; 75 7.62,5.994 | smd 0.254 x 1.473: 26 -5.994,-7.62; 27 -5.512,-7.62; 28 -5.004,-7.62; 29 -4.496,-7.62; 30 -3.988,-7.62; 31 -3.505,-7.62; 32 -2.997,-7.62; 33 -2.489,-7.62; 34 -2.007,-7.62; 35 -1.499,-7.62; 36 -0.991,-7.62; 37 -0.508,-7.62; 38 0,-7.62; 39 0.508,-7.62; 40 0.991,-7.62; 41 1.499,-7.62; 42 2.007,-7.62; 43 2.489,-7.62; 44 2.997,-7.62; 45 3.505,-7.62; 46 3.988,-7.62; 47 4.496,-7.62; 48 5.004,-7.62; 49 5.512,-7.62; 50 5.994,-7.62; 76 5.994,7.62; 77 5.512,7.62; 78 5.004,7.62; 79 4.496,7.62; 80 3.988,7.62; 81 3.505,7.62; 82 2.997,7.62; 83 2.489,7.62; 84 2.007,7.62; 85 1.499,7.62; 86 0.991,7.62; 87 0.508,7.62; 88 0,7.62; 89 -0.508,7.62; 90 -0.991,7.62; 91 -1.499,7.62; 92 -2.007,7.62; 93 -2.489,7.62; 94 -2.997,7.62; 95 -3.505,7.62; 96 -3.988,7.62; 97 -4.496,7.62; 98 -5.004,7.62; 99 -5.512,7.62; 100 -5.994,7.62
DFN10 = smd 0.686 x 0.254: 1 -1.42,1; 2 -1.42,0.5; 3 -1.42,0; 4 -1.42,-0.5; 5 -1.42,-1; 6 1.42,-1; 7 1.42,-0.5; 8 1.42,0; 9 1.42,0.5; 10 1.42,1 | smd 1.6 x 2.3: EP 0,0
TSOT5_MC = smd 1.321 x 0.559: 1 -1.168,0.94; 2 -1.168,0; 3 -1.168,-0.94; 4 1.168,-0.94; 5 1.168,0.94
TSSOP20_MC = smd 1.473 x 0.356: 1 -2.819,2.921; 2 -2.819,2.286; 3 -2.819,1.626; 4 -2.819,0.965; 5 -2.819,0.33; 6 -2.819,-0.33; 7 -2.819,-0.965; 8 -2.819,-1.626; 9 -2.819,-2.286; 10 -2.819,-2.921; 11 2.819,-2.921; 12 2.819,-2.286; 13 2.819,-1.626; 14 2.819,-0.965; 15 2.819,-0.33; 16 2.819,0.33; 17 2.819,0.965; 18 2.819,1.626; 19 2.819,2.286; 20 2.819,2.921
SOIC14-N_MC = smd 1.981 x 0.559: 1 -2.362,3.81; 2 -2.362,2.54; 3 -2.362,1.27; 4 -2.362,0; 5 -2.362,-1.27; 6 -2.362,-2.54; 7 -2.362,-3.81; 8 2.362,-3.81; 9 2.362,-2.54; 10 2.362,-1.27; 11 2.362,0; 12 2.362,1.27; 13 2.362,2.54; 14 2.362,3.81
SOT-23_MC = smd 0.991 x 1.321: 1 -0.94,-1.016; 2 0.94,-1.016; 3 0,1.016
CS10 = smd 1.9 x 2.4: P$1 2.25,0; P$2 -2.25,0

### Placement (x,y rotation side)
C1  19.43,30.84 270 top
C2  19,37.19 0 top
C3  19,39.42 0 top
C4  19.3,24.64 180 top
C5  19.3,22.1 180 top
C6  63.55,22.35 90 top
C7  55.73,18.47 90 bottom
C8  66.85,22.35 90 top
C9  50.8,33.02 0 top
C10  49.83,40.16 90 top
C11  65.07,46.18 90 top
C12  62.81,46.08 270 top
C13  76.07,33.35 180 top
C14  19.05,11.43 180 top
C15  19.05,13.97 180 top
C16  24.03,19.96 0 top
C18  37.62,41.58 270 top
C19  26.19,47.04 180 top
C20  37.08,53.34 90 top
C21  38.61,64.26 270 top
C22  60.45,18.47 90 bottom
C23  58.01,21.29 180 bottom
C24  86.36,17.78 270 top
C25  83.82,17.78 90 top
C54  84.35,37.82 270 top
C55  84.35,34.77 90 top
CONN1  7.39,15.27 0 top
D1  26.67,63.5 0 top
D2  29.21,60.96 0 top
D3  31.75,63.5 0 top
D4  34.29,60.96 0 top
D5  72.39,54.61 0 top
D6  69.85,57.15 0 top
D7  67.31,54.61 0 top
D8  64.77,57.15 0 top
D9  62.23,54.61 0 top
D10  59.69,57.15 0 top
D11  57.15,54.61 0 top
D12  54.61,57.15 0 top
D13  80.01,44.45 270 top
D14  84.35,46.99 270 top
D15  80.01,49.53 270 top
D16  84.35,52.07 270 top
D17  80.01,54.61 270 top
D18  84.35,57.15 270 top
D19  80.01,59.69 270 top
D20  84.35,62.23 270 top
D21  19.05,8.89 0 top
ICSP1  55.88,2.54 0 top
J2  19.05,3.81 180 top
J3  29.21,69.85 0 top
J4  95.25,53.34 270 top
J5  63.5,69.85 0 top
L1  23.88,31.5 180 top
L2  32.18,43.79 0 top
LED1  93.98,17.78 90 top
LED2  93.98,20.32 90 top
LED3  93.98,22.86 90 top
LED4  93.98,25.4 90 top
LED5  93.98,27.94 90 top
LED6  93.98,30.48 90 top
LED7  93.98,33.02 90 top
LED8  93.98,35.56 90 top
M1  3.81,3.81 0 top
M2  3.81,72.39 0 top
M3  97.79,72.39 0 top
M4  97.79,3.81 0 top
R1  72.9,6.38 270 bottom
R2  43.18,27.94 0 top
R3  43.18,25.4 180 top
R9  52.86,34.82 180 top
R10  18.31,18.19 270 top
R11  59.74,36.3 180 bottom
R12  43.18,30.48 0 top
R13  43.18,33.02 180 top
R14  80.77,24.99 0 top
R15  80.8,22.83 0 top
R16  43.18,35.56 0 top
R17  58.83,14.96 180 bottom
R18  75.26,43.08 180 bottom
R19  25.4,50.8 180 top
R20  25.4,53.34 0 top
R21  25.4,58.42 180 top
R22  25.4,55.88 0 top
R23  45.47,71.88 270 top
R24  48.01,71.88 90 top
R25  42.93,71.88 270 top
R26  40.39,71.88 90 top
R27  97.79,17.78 0 top
R28  97.79,20.32 0 top
R29  97.79,22.86 0 top
R30  97.79,25.4 0 top
R31  97.79,27.94 0 top
R32  97.79,30.48 0 top
R33  97.79,33.02 0 top
R34  97.79,35.56 0 top
R35  81.28,17.78 270 top
R36  57.51,7.24 180 bottom
R37  72.39,63.5 270 top
R38  69.85,63.5 270 top
R39  67.31,63.5 270 top
R40  64.77,63.5 270 top
R41  62.23,63.5 270 top
R42  59.69,63.5 270 top
R43  57.15,63.5 270 top
R44  54.61,63.5 270 top
R45  90.17,44.45 180 top
R46  90.17,46.99 180 top
R47  90.17,49.53 180 top
R48  90.17,52.07 180 top
R49  90.17,54.61 180 top
R50  90.17,57.15 180 top
R51  90.17,59.69 180 top
R52  90.17,62.23 180 top
R53  58.42,27.94 180 bottom
RPI1  85.09,7.62 270 top
U1  15.52,30.71 0 top
U2  63.5,34.29 0 top
U3  24.03,17.42 0 top
U5  26.21,43.41 0 top
U6  33.02,53.34 90 top
U7  44.2,64.26 90 top
U8  58.01,18.47 180 bottom
U$1  79.68,27.38 0 bottom
Y1  80.54,36.3 270 top

### Tracks (layer width: path | path; a pad name or v marks a point on that pad's centre or on a via)
5V_POWER_GOOD  (via drill 0.51)
  Top 0.254: U2.19 54.81,31.29 v54.23,30.71 | R3.1 45.29,25.4 v46.74,26.85 | U1.8 16.27,27.67 17.73,26.21 v25.27,26.21
  Bottom 0.254: v54.23,30.71 50.37,26.85 v46.74,26.85 46.69,26.9 40.77,26.9 39.9,26.9 39.65,26.64 38.89,25.88 33.91,25.88 33.05,26.75 25.81,26.75 v25.27,26.21
+3V3  (via drill 0.51)
  Top 0.254: U3.10 25.45,19.39 C16.2 25.22,20.31 v25.22,22.45 | v72.92,3.56 72.95,3.53 74.24,3.53 | C12.2 62.76,45.17 62.76,43.64 64.49,43.64 U2.86 64.49,40.84 | C6.2 63.55,24.41 62.99,24.97 U2.37 | C8.2 66.85,24 67.49,24.64 U2.46 67.49,27.79 | 59.59,24.89 59.51,24.97 U2.30 59.51,27.94 | 54.69,39.8 U2.2 57.1,39.8 | 40.97,25.35 v41,25.35 41.05,25.35 | U2.62 73.51,33.78 arc-90 73.64,33.66 73.81,33.66 arc-90 74.09,33.38 75.2,33.38 arc-90 C13.2 | D8.2 65.72,57.29 v66.17,57.73 | v66.7,2.87 66.73,2.87 | 62.99,26.72 62.99,27.91
  Bottom 0.254: v25.22,22.45 26.98,24.21 32.54,24.21 33.68,25.35 v41,25.35 | R1.2 72.92,5.5 v72.92,3.56 | R11.2 60.64,36.35 v61.9,36.35 | v54.59,19.38 55.66,19.38 C7.2 55.89,19.48 U8.1 | C22.2 v60.45,20.75 | R17.2 59.78,15.06 v61.19,15.06 | v81.66,45.97 79.88,45.97 v77.32,48.54 79.88,51.1 v81.69,51.1 80.39,52.4 v80.39,53.34 80.39,54.89 v81.64,56.13 80.44,57.33 v80.44,58.4 80.9,58.85 v80.9,61.59 | v66.17,57.73 67.74,59.31 68.73,59.31 70.16,57.89 v71.27,57.89 | 58.12,55.19 58.12,51.33 v58.09,51.36 | 58.12,55.19 v61.11,58.19 62.81,59.89 v63.55,59.89 65.23,59.89 66.17,58.95 66.17,57.71 | R36.2 60.29,5.31 64.26,5.31 v66.7,2.87 | R18.2 76.91,42.77 v77.67,42.01 | R53.2 59.27,28.19 v60.6,28.19 | v53.16,49.02 v55.78,49.02 | 58.12,55.19 55.93,57.38 v55.93,59.92
  other vias: 68.38,51.82
  pour Top: 1.09,75.08 1.09,63.86 22.81,63.86 22.81,49.25 28.22,49.23 39.04,49.23 39.07,48.08 38.99,41.76 38.99,38.15 38.13,37.29 38.13,24.66 40.94,21.84 45.59,21.84 46.79,20.65 46.79,2.29 47.75,1.32 100.33,1.32 100.33,75.08
  pour Top: 26.8,43.59 26.8,42.34 26.85,42.29 27.56,42.29 27.86,41.99 27.86,39.98 34.44,39.98 36.6,37.82 38.84,37.82 38.84,41.88 35.89,41.88 35.13,42.65 29.87,42.65 28.93,43.59
+5V  (via drill 0.51)
  Top 0.254: U1.5 14.77,27.93 v14.76,27.91 | v21.82,35.46 21.82,35.79 22.45,36.42 | 80.45,6.79 81.13,7.47 82.78,7.47
  Top 0.406: U5.1 25.04,46.85 C19.2
  Top 1.016: C3.2 20,39.37
  Top 1.27: 80.45,6.79 RPI1.P1-4 | RPI1.P1-2 83,7.68 82.78,7.47 82.46,7.15
  Top 2.54: 26.16,38.23 32.77,38.23 37.9,33.1 37.9,25.55 40.77,22.68 47.47,22.68 47.47,8.91 50.77,5.61 68.38,5.61 69.91,7.15 82.46,7.15
  Bottom 0.254: v14.76,27.91 18.92,27.91 21.82,30.81 v21.82,35.46
  pour Top: 27.15,33.45 22.5,33.45 19.43,36.53 19.43,42.75 19.91,43.23 22.63,43.23 22.99,43.59 23.01,45.47 25.73,45.49 25.73,42.47 26.26,42.47 26.26,41.81 27.23,41.81 27.23,33.53
ADDR_SEL2  (via drill 0.51)
  Top 0.241: v32.05,52.02 U6.4
  Top 0.254: R19.1 26.34,50.8 v27.56,52.02 26.25,53.33 R20.2
  Bottom 0.241: v27.56,52.02 v32.05,52.02
ADDR_SEL3  (via drill 0.51)
  Top 0.241: U6.16 32.61,56.08 v32.61,54.66
  Top 0.254: v27.51,54.66 26.29,55.88 R22.2 R21.1
  Bottom 0.254: v27.51,54.66 v32.61,54.66
ALERT_N  (via drill 0.51)
  Top 0.241: 40.74,29.11 41.91,27.94 R2.1 | v40.64,29.21 40.64,34.29 41.91,35.56 R16.1
  Top 0.254: U2.18 53.7,31.8 v52.7,30.81 | v40.49,36.27 41.62,36.27 R16.1 | U3.7 26.65,16.92 27.69,17.96 27.69,26.04 28.4,26.75 33.63,26.75 v34.52,27.64 | v40.64,29.21 40.74,29.11
  Bottom 0.254: v52.7,30.81 47.08,30.81 R16.1 41.2,35.56 v40.49,36.27 | v34.52,27.64 39.06,27.64 v40.64,29.21
ANALOG0  (via drill 0.51)
  Top 0.254: 35.94,51.13 U6.10 v37.67,50.52 38.53,50.52 39.95,51.94 39.95,58.06 40.39,58.5 U7.1 | v37.62,47.5 38.35,46.76 44.78,46.76 46.02,45.52 46.02,30.84 48.56,28.3 U2.25
  Bottom 0.254: v37.62,47.5 37.62,50.47 v37.67,50.52
ANALOG0_IN  (via drill 0.51)
  Top 0.241: U6.8 v34.65,53.85
  Top 0.254: J3.2 D1.3
  Bottom 0.241: v34.65,53.85 34.65,54.66 34.24,55.07 26.67,62.64 J3.2
ANALOG1  (via drill 0.51)
  Top 0.254: 48.01,61.98 U7.7 48.01,49.17 46.53,47.7 | U2.24 48.95,28.78 46.53,31.19 46.53,47.7 | U6.1 30.1,49.96 29.69,49.55 28.85,49.55 v28.83,49.58 | v36.22,48.46 45.77,48.46 46.53,47.7
  Bottom 0.254: v28.83,49.58 30.33,48.08 31.52,48.08 33.53,50.09 34.59,50.09 v36.22,48.46
ANALOG1_IN
  Top 0.241: U6.3 31.34,50.57 31.34,51.46 29.26,53.54 29.26,61.95 D2.3
  Top 0.254: D2.3 J3.3
ANALOG2
  Top 0.241: 48.63,72.02 48.26,72.39 R24.2 | 48.11,64.87 48.01,64.97 U7.8
  Top 0.254: U7.8 48.01,68.78 49,69.77 49,71.65 48.63,72.02 | U2.23 49.28,29.29 47.04,31.52 47.04,43.94 47.04,44.65 47.04,47.47 49.43,49.86 49.43,63.55 48.11,64.87
ANALOG2_IN  (via drill 0.51)
  Top 0.241: 45.72,72.39 R23.1
  Top 0.254: J3.4 D3.3 31.75,64.77 v30.33,66.19 | 45.72,72.39 45.72,72.62 44.2,74.14 39.55,74.14 38.68,73.28 v38.68,67.89
  Bottom 0.254: v30.33,66.19 36.98,66.19 v38.68,67.89
ANALOG3  (via drill 0.51)
  Top 0.241: U7.14 40.44,66.52
  Top 0.254: v41.58,71.91 41.21,71.91 R26.2 39.37,71.72 39.37,70.31 40.39,69.29 U7.14 | v49.94,66.57 49.94,49.61 47.57,47.24 47.57,31.75 49.53,29.79 U2.22
  Bottom 0.254: v49.94,66.57 44.6,71.91 v41.58,71.91
ANALOG3_IN  (via drill 0.51)
  Top 0.241: v44.45,69.85 44.45,71.12 43.18,72.39 R25.1
  Top 0.254: R25.1 42.93,72.64 | D4.3 J3.5
  Bottom 0.241: J3.5 v44.45,69.85
BOOST
  Top 0.254: U1.10 17.47,30.46 17.94,29.99 C1.2
GND  (via drill 0.51)
  Top 0.254: C16.1 23.18,19.88 23.5,19.56 23.5,17.96 U3.EP 24.03,16.84 arc-90 23.61,16.42 21.2,16.42 arc90 21.16,16.38 | U1.15 15.27,30.96 arc90 U1.ECP | 15.77,31.14 U1.14 | 15.77,31.14 arc90 15.77,31.14 | U1.4 14.9,29.96 arc90 15.16,30.23 15.16,30.35 U1.ECP | 15.77,31.14 15.77,30.96 U1.ECP | U6.7 33.98,51.94 v33.5,52.43 | C20.1 35.73,52.49 v35.71,52.48 | D1.1 25.66,62.46 v24.33,62.46 | v24.43,59.97 24.43,58.53 arc90 R21.2 | v24.46,49.28 24.46,50.71 arc-90 R19.2 | C19.1 28.31,45.87 v28.6,45.87 | v28.22,58.32 28.26,58.36 D2.1 | U5.2 25.6,43.41 26.26,44.07 v26.26,45.34 | D3.1 30.25,62.95 v30.25,64.26 | v32.03,59.92 33.28,59.92 arc-90 D4.1 | U6.18 31.39,54.69 v30.43,53.72 | v37.29,64.29 37.78,64.29 C21.1 | U7.11 44.2,68.38 v44.17,68.4 | v52.22,56.11 53.66,56.11 D12.1 | D10.1 58.74,56.93 v58.12,57.56 | D8.1 63.82,57.26 v63.35,57.73 | v60.94,51.84 60.94,53.16 D9.1 | v56.13,52.07 56.13,53.44 D11.1 | D6.1 68.9,57.54 v68.45,57.99 | v71.4,52.02 71.4,53.47 D5.1 | v66.32,51.99 66.32,53.47 D7.1 | C12.1 62.81,48.13 v62.79,48.16 | C11.2 v65.08,48.44 | v72.57,40.84 72.31,40.84 71.75,40.28 U2.75 | 49.77,39.29 C10.1 v49.82,38.06 v49.84,38.05 | C8.1 v66.85,20.34 | C6.1 v63.55,20.37 | U2.45 67,25.55 v66.6,25.15 | U2.31 59.99,25.65 v60.48,25.17 | U2.36 62.51,25.45 v62.03,24.97 | v58.37,32.87 57.94,33.3 U2.15 | C9.1 50.01,33.08 v50.01,34.29 | C13.1 78.16,33.35 arc90 v78.21,33.4 | v77.39,45.44 78.87,45.44 arc-90 D13.1 | v81.69,48.01 83.19,48.01 arc-90 D14.1 | v77.32,50.47 D15.1 arc90 D15.1 | v81.66,53.09 83.19,53.09 arc-90 D16.1 | v77.34,55.47 78.82,55.47 arc90 D17.1 | v81.74,58.12 83.24,58.12 arc-90 D18.1 | v77.39,60.71 78.84,60.71 arc-90 D19.1
  Top 0.254: v83.24,64.54 83.24,63.2 arc90 D20.1 | C24.1 85.83,19.26 v85.83,20.37 | v87.1,20.34 87.1,19.18 86.44,19.18 86.44,18.67 86.41,18.67 | v64.92,22.07 65.35,21.64 65.35,18.77 v64.47,17.88 | U2.65 73.56,35.28 v74.24,35.97 | U6.13 34.65,57.51 v34.49,57.66 | 84.35,36.32 C54.2 C55.2
  Top 0.406: v83.11,36.32 84.35,36.32
  Bottom 0.254: 60.29,17.65 C22.1 58.18,17.62 U8.3 58.01,17.62 C7.1
  other vias: 15.52,30.71 21.97,24.77 23.09,24.77 22.5,23.75 23.62,23.75 21.97,22.73 23.09,22.73 22.5,21.72 23.62,21.72 22.05,10.16 23.16,10.16 24.28,10.16 22.58,9.14 23.7,9.14 24.82,9.14 23.16,8.13 24.28,8.13 22.58,7.11 23.7,7.11 24.82,7.11 22.02,14.2 23.14,14.2 24.26,14.2 22.56,13.18 23.67,13.18 24.79,13.18 22.02,12.17 23.14,12.17 24.26,12.17 22.56,11.15 23.67,11.15 24.79,11.15 14.63,40.39 15.62,39.85 16.59,40.44 16.59,39.32 15.62,38.73 14.63,39.27 14.63,38.13 15.62,37.59 16.59,38.18 16.59,37.06 16.59,35.94 15.62,36.47 14.63,37.01 14.63,35.89 15.62,35.36 7.82,7.98 7.29,6.88 8.48,6.88 9.63,6.88 10.79,6.88 11.96,6.88 13.16,6.88 13.77,5.87 12.6,5.87 11.38,5.87 10.24,5.87 9.07,5.87 7.85,5.87 8.46,4.8 9.63,4.8 10.82,4.8 12.01,4.8 13.21,4.8 9.04,3.73 10.24,3.73 11.51,3.73 12.73,3.73 13.94,3.73 13.34,2.74 12.12,2.74 10.87,2.74 9.63,2.74 8.26,2.74 35.38,44.02 36.6,44.04 37.82,44.04 37.19,45.03 35.99,45.06
  pour Top: 20.29,7.7 19.53,6.93 19.53,3.05 23.7,3.05 25.78,5.13 25.78,16.43 25.15,17.07 20.73,17.07 20.29,16.64 20.29,15.88
  pour Top: 17.78,41.27 18.26,40.79 18.26,36.27 16.76,34.77 14.78,34.77 13.87,35.69 13.87,40.61 14.53,41.27
  pour Bottom: 1.07,63.88 22.83,63.88 22.83,62.97 22.81,62.97 22.81,43.61 12.24,43.61 12.24,24.13 0.79,24.13 0.79,20.9 0.79,1.17 32.59,1.17 32.59,22.15 37.08,22.15 46.86,22.15 46.86,20.88 46.86,1.32 79.5,1.32 100.33,1.32 100.33,74.8 100.33,75.08 6.43,75.08 1.07,75.08
  pour Top: 19.66,25.27 24.03,25.27 24.03,21.26 19.66,21.26
  pour Top: 0.86,11.43 13.08,11.43 14.73,9.78 14.73,1.32 0.79,1.32 0.81,11.38
  pour Top: 37.8,45.57 38.3,45.06 38.3,42.75 38.02,42.47 36.37,42.47 35.69,43.15 35.15,43.15 34.67,43.64 34.67,44.91 35.33,45.57
I2C1_SCL  (via drill 0.51)
  Top 0.254: U2.66 69.93,35.79 69.6,35.46 v69.6,33.27 | v78.63,28.96 78.63,26.29 R14.1 78.84,24.99 77.92,24.07 77.92,20.08 77.65,19.81 77.65,14.61 77.92,14.34 RPI1.P1-5
  Bottom 0.254: v69.6,33.27 71.63,31.24 76.96,31.24 78.63,29.58 v78.63,28.96
I2C1_SDA  (via drill 0.51)
  Top 0.254: R15.1 79.95,23 | v80.37,29.72 80.37,27.69 81.56,26.49 82.75,26.49 83.52,25.73 83.52,22.5 82.91,21.89 80.9,21.89 R15.1 | RPI1.P1-3 78.64,14.58 78.64,16.74 v79.2,17.3 | U2.67 72.67,36.3 73.46,37.08 v75.77,37.08 | v79.2,19.48 79.2,22.08 R15.1
  Bottom 0.254: v80.37,29.72 80.37,33.96 77.24,37.08 v75.77,37.08 | v79.2,17.3 v79.2,19.48
I2C2_SCL  (via drill 0.51)
  Top 0.241: v42.32,31.75 42.32,30.48 R12.1
  Top 0.254: U3.9 26.13,17.92 26.49,18.29 v26.49,30.79 26.49,30.99 27.33,31.83 v34.19,31.83 | U6.5 32.69,48.97 34.31,47.35 v34.31,46.97 | R12.1 42.34,30.48 | U2.58 68.33,31.8 66.17,33.96 66.17,36.02 v65.13,37.06
  Bottom 0.254: v65.13,37.06 64.64,37.54 52.96,37.54 51.71,36.3 44.86,36.3 43.28,37.87 39.9,37.87 38.86,36.83 38.86,35.2 v42.32,31.75 42.24,31.83 v34.19,31.83 | v34.31,46.97 26.49,39.14 v26.49,30.79
I2C2_SDA  (via drill 0.51)
  Top 0.254: U3.8 26.42,17.42 27.05,18.06 27.05,28.35 27.94,29.23 v34.09,29.23 | U6.6 33.35,49.17 34.65,47.88 35.03,47.88 v36.02,46.89 | v43.94,31.75 43.94,32.93 arc-90 R13.1 | v66.02,38.05 67.21,36.85 67.21,33.78 68.71,32.28 U2.59
  Bottom 0.254: v43.94,31.75 43.94,31.11 43.38,30.56 41.94,30.56 41.45,31.04 39.42,31.04 37.62,29.23 v34.09,29.23 33.3,30.02 33.3,33.12 37.08,36.91 37.08,38.46 | 37.08,38.46 37.08,40.72 34.44,43.36 34.44,44.81 36.02,46.38 v36.02,46.89 | v66.02,38.05 52.73,38.05 51.49,36.8 45.14,36.8 43.48,38.46 37.08,38.46
INOUT00
  Top 0.254: R45.2 D13.3 72.34,44.45 70.59,42.7 69.83,42.7 69.49,42.37 U2.76
INOUT00_R
  Top 0.254: R45.1 J4.9
INOUT01
  Top 0.254: R46.2 D14.3 74.09,46.99 70.36,43.26 69.42,43.26 69.01,42.85 U2.77
INOUT01_R
  Top 0.254: R46.1 J4.8
INOUT02
  Top 0.254: R47.2 89.32,49.54 88.95,49.91 81.49,49.91 D15.3 75.82,49.53 70.1,43.81 69.04,43.81 68.5,43.28 U2.78
INOUT02_R
  Top 0.254: R47.1 J4.7
INOUT03
  Top 0.254: 89.41,52.07 R48.2 D16.3 77.62,52.07 69.88,44.32 68.4,44.32 67,42.93 U2.81
INOUT03_R
  Top 0.254: R48.1 J4.6
INOUT04
  Top 0.254: R49.2 88.92,54.61 88.92,54.99 81.49,54.99 D17.3 80.93,54.79 80.78,54.63 78.13,54.63 77.7,54.2 77.7,52.91 69.62,44.83 68.17,44.83 66.5,43.16 U2.82
INOUT04_R
  Top 0.254: R49.1 J4.5
INOUT05
  Top 0.254: R50.2 D18.3 77.6,57.15 76.3,55.85 76.3,55.09 77.17,54.23 77.17,53.11 69.39,45.34 67.94,45.34 65.99,43.38 U2.83
INOUT05_R
  Top 0.254: R50.1 J4.4
INOUT06
  Top 0.254: 81.5,60.08 D19.3 77.88,59.69 75.69,57.51 75.69,54.81 76.61,53.9 76.61,53.34 69.19,45.92 67.77,45.92 65.51,43.66 U2.84 | 81.5,60.08 81.53,60.08 81.54,60.07 86.84,60.07 87.22,59.69 R51.2 89.33,59.69 | 81.5,60.08 81.52,60.1
INOUT06_R
  Top 0.254: R51.1 J4.3
INOUT07  (via drill 0.51)
  Top 0.254: 85.62,62.23 R52.2 | 85.62,62.23 D20.3 | v83.82,40.64 76.2,40.64 72.34,36.78 U2.68 | 85.62,62.23 86.36,62.97 v86.36,63.5
  Bottom 0.254: v86.36,63.5 86.36,43.18 v83.82,40.64
INOUT07_R
  Top 0.254: R52.1 J4.2
INOUT08  (via drill 0.51)
  Top 0.254: R37.2 D5.3 v72.39,50.98 | U2.93 61.01,40.41 v61.04,40.39
  Bottom 0.254: v61.04,40.39 61.04,43.28 62.94,45.19 66.6,45.19 v72.39,50.98
INOUT08_R
  Top 0.254: R37.1 J5.9
INOUT09  (via drill 0.51)
  Top 0.254: R38.2 D6.3 v69.85,50.8 | U2.94 60.5,44.04 v60.98,44.53
  Bottom 0.254: v69.85,50.8 69.85,49.23 66.5,45.87 62.33,45.87 v60.98,44.53
INOUT09_R
  Top 0.254: R38.1 J5.8
INOUT10  (via drill 0.51)
  Top 0.254: R39.2 D7.3 v67.31,49.91 | U2.98 58.5,40.87 v59.05,40.31
  Bottom 0.254: v59.05,40.31 59.05,46.51 62.46,49.91 v67.31,49.91
INOUT10_R
  Top 0.254: R39.1 J5.7
INOUT11  (via drill 0.51)
  Top 0.254: R40.2 D8.3 v64.77,52.12 | U2.99 v57.99,44.78
  Bottom 0.254: v64.77,52.12 64.77,51.18 64.21,50.62 62.43,50.62 57.99,46.18 v57.99,44.78
INOUT11_R
  Top 0.254: R40.1 J5.6
INOUT12  (via drill 0.51)
  Top 0.254: R41.2 D9.3 v62.23,51.92 | U2.100 57.07,41.91 56.84,42.14 v56.84,43.69
  Bottom 0.254: v56.84,43.69 56.84,45.77 62.23,51.16 v62.23,51.92 62.23,51.18
INOUT12_R
  Top 0.254: R41.1 J5.5
INOUT13  (via drill 0.51)
  Top 0.254: R42.2 D10.3 v59.69,52.38 | v53.31,42.7 53.31,40.16 54.18,39.29 U2.3
  Bottom 0.254: v59.69,52.38 59.69,50.29 53.29,43.89 53.31,43.87 v53.31,42.7
INOUT13_R
  Top 0.254: R42.1 J5.4
INOUT14
  Top 0.254: R43.2 D11.3 57.15,48.54 52.38,43.76 52.38,42.29 52.7,41.96 52.7,40.03 53.95,38.79 U2.4
INOUT14_R
  Top 0.254: R43.1 J5.3
INOUT15
  Top 0.254: R44.2 D12.3 54.61,46.81 51.77,43.97 51.77,42.11 52.15,41.73 52.15,39.83 53.7,38.28 U2.5
INOUT15_R
  Top 0.254: R44.1 J5.2
JTAG_TCK  (via drill 0.51)
  Top 0.254: RPI1.P1-22 58.93,11.56 60.81,11.56 61.42,12.17 61.42,13.49 v63.7,15.77 | U2.38 63.5,25.63 65.89,23.24 65.89,19.81 65.96,19.74 v65.96,18.03
  Bottom 0.254: v63.7,15.77 v65.96,18.03
JTAG_TDI  (via drill 0.51)
  Top 0.254: v83.97,20.68 84.66,21.36 84.66,28.5 81.86,31.29 73.25,31.29 72.64,31.9 72.64,32.51 72.36,32.79 U2.60 | RPI1.P1-15 66.47,11.51 70.79,11.51 71.58,12.29 71.58,14.94 v76.15,19.51
  Bottom 0.254: v76.15,19.51 77.32,20.68 v83.97,20.68
JTAG_TDO
  Top 0.241: 66.47,8.97 70.74,8.97 71.58,9.8
  Top 0.254: U2.61 72.72,33.3 73.2,32.82 73.2,32.08 73.43,31.85 83.92,31.85 88.75,27.03 88.75,15.04 85.14,11.43 72.06,11.43 71.58,10.95 71.58,9.8 | RPI1.P1-16 66.47,8.97
JTAG_TMS  (via drill 0.51)
  Top 0.254: v53.72,8.66 54.84,7.54 64.44,7.54 v65.2,8.31 | U2.17 56.9,32.28 57.91,31.27 v59.61,31.27
  Bottom 0.254: v53.72,8.66 53.75,8.69 53.75,13.31 54.15,13.72 54.15,16.46 53.03,17.58 53.03,20.04 59.59,26.59 60.78,26.59 61.82,27.64 61.82,30.15 60.71,31.27 v59.61,31.27 | v65.2,8.31 64.59,8.31 RPI1.P1-18
LED1_N  (via drill 0.51)
  Top 0.254: LED1.C 90.98,17.78 v90.96,17.75 | U2.47 68,24.36 69.42,22.94 69.42,22.07 70.16,21.34 v71.09,21.34
  Bottom 0.254: v90.96,17.75 89.74,18.97 89.74,20.8 88.62,21.92 71.68,21.92 v71.09,21.34
LED2_N  (via drill 0.51)
  Top 0.254: U2.48 68.5,24.61 v70.33,22.78 | LED2.C 91.01,20.32 v90.98,20.34
  Bottom 0.254: v90.98,20.34 88.88,22.45 70.66,22.45 v70.33,22.78
LED3_N  (via drill 0.51)
  Top 0.254: U2.49 69.01,24.89 70.05,23.85 v71.27,23.85 | v90.93,22.86 LED3.C
  Bottom 0.254: v90.93,22.86 89.84,22.86 89.59,23.11 72.01,23.11 v71.27,23.85
LED4_N  (via drill 0.51)
  Top 0.254: LED4.C 90.96,25.4 v90.93,25.38 | v70.76,25.43 70.1,26.09 69.52,26.09 69.49,26.11 U2.50
  Bottom 0.254: v70.76,25.43 71.55,25.02 72.95,23.62 89.18,23.62 v90.93,25.38
LED5_N  (via drill 0.51)
  Top 0.254: U2.51 72.59,28.3 74.98,25.91 v74.98,25.86 | LED5.C 90.83,27.94 v90.81,27.96
  Bottom 0.254: v74.98,25.86 85.06,25.86 87.1,27.89 90.73,27.89 v90.81,27.96
LED6_N  (via drill 0.51)
  Top 0.254: U2.52 73.38,28.78 v74.09,28.07 | v90.81,30.48 LED6.C
  Bottom 0.254: v90.81,30.48 88.01,30.48 84.48,26.95 76.43,26.95 75.31,28.07 v74.09,28.07
LED7_N  (via drill 0.51)
  Top 0.254: U2.53 73.56,29.29 74.14,29.87 v74.19,29.87 | v90.75,33.02 LED7.C
  Bottom 0.254: v90.75,33.02 89.59,33.02 84.12,27.56 77.01,27.56 74.7,29.87 v74.19,29.87
LED8_N  (via drill 0.51)
  Top 0.254: v90.75,35.56 LED8.C | U2.80 67.49,40.34 v67.94,39.88
  Bottom 0.254: 90.73,35.56 v90.75,35.56 88.59,37.72 84.07,37.72 81.99,39.8 71.68,39.8 71.02,40.46 69.29,40.46 68.71,39.88 v67.94,39.88
MCLR  (via drill 0.51)
  Top 0.254: v62.13,34.29 U2.13 54.24,34.29 R9.1 | v62.23,17.78 61.19,16.74 v49.94,16.74
  Bottom 0.241: v62.23,17.78 64.77,20.32
  Bottom 0.254: 64.77,20.32 68.58,24.13 68.58,29.64 63.93,34.29 v62.13,34.29 | v49.94,16.74 48.28,15.09 48.28,3.79 ICSP1.1
N$3
  Top 0.254: U7.13 41.66,69.76 R26.1
N$4
  Top 0.241: U6.12 35.38,56.24 35.38,58.29 39.73,62.64 39.73,63.04 39.95,63.27 42.93,63.27 U7.3
N$5
  Top 0.254: LED1.A R27.1
N$6
  Top 0.241: 41.66,61.34 U7.2
  Top 0.254: 41.66,61.34 41.66,58.19 40.97,57.51 40.97,52.09 38.25,49.38 35.59,49.38 35.31,49.66 U6.9
N$7  (via drill 0.51)
  Top 0.241: v44.25,60.15 45.47,61.37 U7.5
  Top 0.254: v32.36,58.57 30.84,57.05 30.73,56.95 U6.19
  Bottom 0.241: v32.36,58.57 33.93,60.15 v44.25,60.15
N$8  (via drill 0.51)
  Top 0.241: U6.2 30.84,50.42 v30.84,49.02 | v43.26,56.62 46.74,60.1 U7.6
  Bottom 0.241: v30.84,49.02 32.44,50.62
  Bottom 0.254: 32.44,50.62 32.46,50.65 35.48,50.65 36.47,51.64 38.28,51.64 v43.26,56.62
N$9
  Top 0.241: R23.2 45.72,71.12
  Top 0.254: U7.10 R23.2
N$11
  Top 0.254: LED2.A R28.1
N$12
  Top 0.241: R25.2 43.18,71.12
  Top 0.254: U7.12 R25.2
N$13
  Top 0.254: LED3.A R29.1
N$14
  Top 0.254: LED4.A R30.1
N$15
  Top 0.254: LED5.A R31.1
N$16
  Top 0.254: LED6.A R32.1
N$17
  Top 0.254: LED7.A R33.1
N$18
  Top 0.254: LED8.A R34.1
OSCI
  Top 0.254: Y1.P$1 84.23,34.05 C55.1 | 80.3,34.29 arc-90 Y1.P$1 | U2.63 80.3,34.29 | 80.3,34.29 Y1.P$1
OSCO
  Top 0.254: C54.1 84.23,38.55 Y1.P$2 80.33,38.33 80.03,38.33 76.5,34.8 U2.64
PGC  (via drill 0.51)
  Top 0.254: U2.26 57.51,25.53 55.47,23.5 v53.82,23.5
  Bottom 0.254: ICSP1.5 56.69,5.54 51.28,5.54 50.22,6.6 50.22,14.61 51.97,16.36 51.97,21.64 v53.82,23.5
PGD  (via drill 0.51)
  Top 0.254: v50.6,22.5 55.7,22.5 57.99,24.79 U2.27
  Bottom 0.254: ICSP1.4 56.06,1.45 48.54,1.45 47.4,2.59 47.4,20.83 49.07,22.5 v50.6,22.5
RPI+3V3
  Top 0.254: 86.26,16.93 C24.2 | C25.1 83,16.83 83,16.93
  Top 0.813: 86.26,16.93 R35.2 83,16.93 | RPI1.P1-1 83,16.83
  Bottom 0.813: RPI1.P1-1 83,13.68 81.97,14.71 64.62,14.71 RPI1.P1-17
RPI-RDX0
  Top 0.254: RPI1.P1-10 72.9,10.16
  Bottom 0.241: 72.9,10.16 RPI1.P1-10
  Bottom 0.254: R1.1 72.9,10.16
SPI_CE0  (via drill 0.51)
  Top 0.241: 64.01,8.91 63.25,8.15 57.12,8.15
  Top 0.254: 64.01,8.91 64.01,13.66 68.02,17.68 v71.09,17.68 | RPI1.P1-24 57.12,8.15 | v74.47,21.03 74.47,24.54 v73.38,25.63 | v68.89,37.29 U2.69
  Bottom 0.254: v74.47,21.03 71.12,17.68 v71.09,17.68 | R36.1 55.05,8.84 RPI1.P1-24 | v73.38,25.63 70.87,28.14 70.87,29.59 67.89,32.56 67.89,36.3 v68.89,37.29
SPI_CE1  (via drill 0.51)
  Top 0.254: U2.14 61.32,33.78 61.87,33.22 61.9,33.22 v62.13,32.99 | v63.4,31.65 61.24,29.49 v60.63,29.49 | RPI1.P1-26 53.8,11.51 53.8,14.5 v52.81,15.49
  Bottom 0.254: v62.13,32.99 63.4,31.73 v63.4,31.65 | v60.63,29.49 59.12,29.49 R53.1 57.57,25.41 52.5,20.34 52.5,15.8 v52.81,15.49
SPI_SCK  (via drill 0.51)
  Top 0.254: v74.4,41.53 74.4,39.57 72.62,37.8 U2.70 69.88,37.8 69.49,38.18 67.28,38.18 66.06,39.4 64.72,39.4 63.73,38.41 63.73,35.36 65.15,33.93 v65.15,30.15 | RPI1.P1-23 55.05,15.56 55.65,16.15 61.95,16.15 63.22,17.42 63.22,18.36 61.92,19.66 61.92,21.92 v61.32,22.53 | U2.10 57.1,35.79 57.58,35.31 59.82,35.31 60.55,36.04 60.55,38.56 v60.12,38.99
  Bottom 0.254: v74.4,41.53 74.39,41.16 R18.1 73.39,43.76 67.16,43.76 62.38,38.99 v60.12,38.99 | v61.32,22.53 63.02,24.23 63.6,24.23 65.15,25.78 v65.15,30.15
SPI_SDI  (via drill 0.51)
  Top 0.254: v50.37,19.3 51.74,17.93 v54.18,17.93 | v56.29,14.96 57.94,14.96 RPI1.P1-19 | v57.68,36.52 57.45,36.3 U2.9 54.69,36.3 54.69,34.8 U2.12
  Bottom 0.254: v50.37,19.3 51.36,20.3 51.36,21.79 52.55,22.99 52.55,24.92 56.69,29.06 56.69,33.27 58.89,35.47 R11.1 58.89,36.52 v57.68,36.52 | v54.18,17.93 54.79,17.32 54.79,15.27 55.09,14.96 v56.29,14.96
SPI_SDO  (via drill 0.51)
  Top 0.254: U2.72 70.18,38.79 v69.6,39.37 69.09,38.86 67.61,38.86 66.5,39.98 64.49,39.98 63.14,38.63 63.14,36.22 62.23,35.31 61.65,35.31 61.14,34.8 57.28,34.8 56.79,35.28 U2.11
  Bottom 0.254: RPI1.P1-21 57.59,14.58 R17.1 59.07,16.05 61.9,16.05 63.25,17.4 63.25,18.03 69.14,23.93 69.14,30.12 67.18,32.08 67.18,37.52 68.45,38.79 v69.6,39.37
SUPPLY
  Top 0.254: U3.2 20.08,17.92 19.18,17.02 18.55,17.02 R10.2 18.1,16.57
  Top 0.61: C15.2 18.1,16.79 R10.2
  Top 1.27: J2.2 17.78,8.84 D21.K
  pour Top: 1.02,23.77 13.59,23.77 15.27,22.1 15.27,15.27 15.98,14.55 17.73,14.55 18.11,14.17 18.11,7.19 17.73,6.81 16.08,6.81 15.6,7.29 15.6,10.64 12.47,13.77 12.47,15.09 9.6,17.96 0.99,17.96 0.99,23.77
SW
  pour Top: 14.07,31.47 14.66,32.05 14.78,32.05 14.78,32.72 15.01,32.94 16.1,32.94 16.26,32.79 16.26,32.08 16.46,32.08 16.46,31.9 16.89,31.47 17.83,31.47 18.52,30.78 18.52,28.78 20.55,26.75 20.78,26.75 20.85,26.75 23.72,26.75 24.31,27.33 24.31,29.82 20.24,33.88 20.04,33.88 13.79,33.91 13.79,31.5
U5_SWITCH
  Top 0.61: U5.5 29.74,44.35 L2.1
U7C_INVERTING
  Top 0.241: 47.5,70.36 46.99,69.85 | R24.1 48.26,71.12
  Top 0.254: U7.9 46.74,69.6 47.5,70.36 48.01,70.87 R24.1
VDDCORE
  Top 0.254: U2.85 65,45.15 C11.1
VIN  (via drill 0.51)
  Top 0.254: U3.1 20.06,18.42 18.92,19.56 18.34,19.56 | R10.1 18.34,19.56 | 18.34,19.56 18.34,19.61 arc-90 18.35,19.63 | U1.11 17.86,30.96 v18.06,31.17 | 13.56,30.71 13.56,30.46 U1.3 U1.2
  Top 0.813: C4.2 18.39,24.66 14.71,24.66 12.8,26.57 v12.8,30.1 12.8,30.71 | 12.8,30.71 v12.8,31.24 v12.8,32.41 | 12.8,30.71 13.56,30.71
  Top 1.27: 18.35,19.63 C5.2 C4.2
  Bottom 0.813: v18.06,31.17 16.82,32.41 v12.8,32.41 v12.8,30.1
VREF  (via drill 0.51)
  Top 0.254: v59,23.77 U2.29
  Bottom 0.254: U8.2 58.95,21.29 C23.2 59,21.43 v59,23.77

### Text on the board
Top: TOP
Bottom: BOTTOM
tPlace: TRISThis | V2.0